# Altium schematic sheet USB.SchDoc
size A
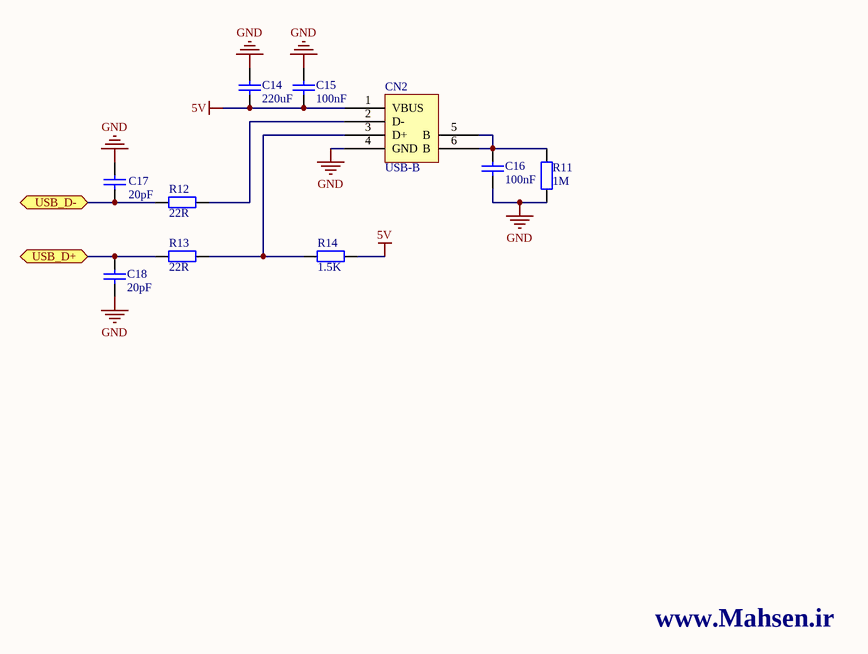
[diagram p0: USB.SchDoc]

## Parts
C14  220uF  [0805]
C15  100nF  [0805]
C16  100nF  [0805]
C17  20pF  [0805]
C18  20pF  [0805]
CN2  USB-B  [CONN_USB]
R11  1M  [0805]
R12  22R  [0805]
R13  22R  [0805]
R14  1.5K  [0805]

## Ports
USB_D+ (bidir), USB_D- (bidir)

## Nets
5V: C14.2 C15.2 CN2.1(VBUS) R14.2
GND: C14.1 C15.1 C16.2 C17.1 C18.2 CN2.4(GND) R11.1
USB_D+: C18.1 R13.2 ; port USB_D+
USB_D-: C17.2 R12.2 ; port USB_D-
NetC16_1: C16.1 CN2.5(B) CN2.6(B) R11.2
NetCN2_2: CN2.2(D-) R12.1
NetCN2_3: CN2.3(D+) R13.1 R14.1

## Notes on the sheet
- www.Mahsen.ir

## Library data of the parts
C14-C18 = Cap: Capacitor; Published: 8-Jun-2000; LatestRevisionDate: 17-Jul-2002; LatestRevisionNote: Re-released for DXP Platform.; PackageReference: RAD-0.3; Publisher: Altium Limited; PackageDescription: Radial Cap, Thru-Hole; 2 Leads; 0.3 in Pin Spacing
  C14: Value: 220uF
  C15 C16: Value: 100nF
  C17 C18: Value: 20pF
R11-R14 = Res2: Resistor; Published: 8-Jun-2000; LatestRevisionDate: 17-Jul-2002; LatestRevisionNote: Re-released for DXP Platform.; PackageReference: AXIAL-0.4; Publisher: Altium Limited; PackageDescription: Axial Device, Thru-Hole; 2 Leads; 0.4 in Pin Spacing
  R11: Value: 1M
  R12 R13: Value: 22R
  R14: Value: 1.5K